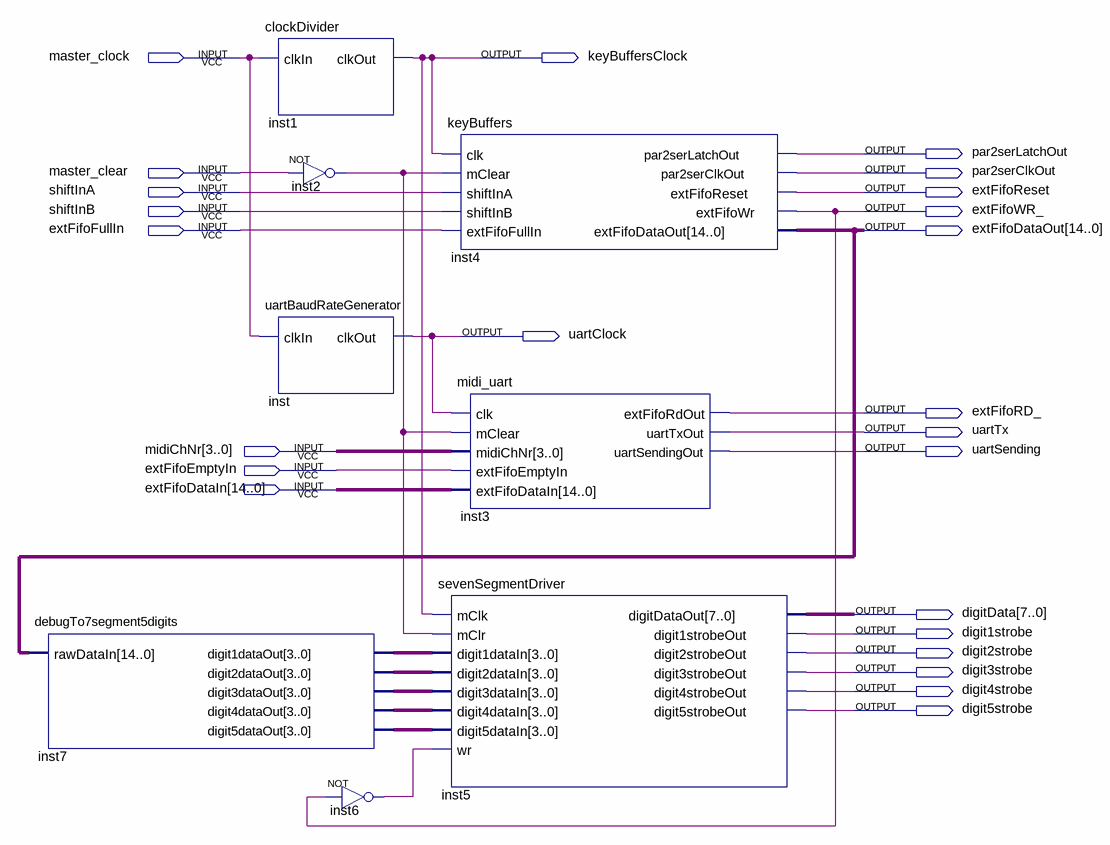
[diagram p0: schematic sheet]
// Quartus schematic Main.bdf as structural Verilog: 8 symbols, 24 pins
module Main (
  input  master_clock,
  input  master_clear,
  input  shiftInA,
  input  shiftInB,
  input  extFifoFullIn,
  input  [3:0] midiChNr,
  input  extFifoEmptyIn,
  input  [14:0] extFifoDataIn,
  output keyBuffersClock,
  output par2serLatchOut,
  output par2serClkOut,
  output extFifoReset,
  output extFifoWR_,
  output [14:0] extFifoDataOut,
  output uartClock,
  output extFifoRD_,
  output uartTx,
  output uartSending,
  output [7:0] digitData,
  output digit1strobe,
  output digit2strobe,
  output digit3strobe,
  output digit4strobe,
  output digit5strobe
);

  wire inst2_out, inst6_out;
  wire [3:0] inst7_digit1dataout, inst7_digit2dataout, inst7_digit3dataout, inst7_digit4dataout,
       inst7_digit5dataout;

  debugTo7segment5digits inst7 (
    .rawDataIn(extFifoDataOut), .digit1dataOut(inst7_digit1dataout), .digit2dataOut(inst7_digit2dataout),
    .digit3dataOut(inst7_digit3dataout), .digit4dataOut(inst7_digit4dataout),
    .digit5dataOut(inst7_digit5dataout));
  clockDivider inst1 (.clkIn(master_clock), .clkOut(keyBuffersClock));
  not inst2 (inst2_out, master_clear);
  uartBaudRateGenerator inst (.clkIn(master_clock), .clkOut(uartClock));
  not inst6 (inst6_out, extFifoWR_);
  keyBuffers inst4 (
    .clk(keyBuffersClock), .mClear(inst2_out), .shiftInA(shiftInA), .shiftInB(shiftInB),
    .extFifoFullIn(extFifoFullIn), .par2serLatchOut(par2serLatchOut), .par2serClkOut(par2serClkOut),
    .extFifoReset(extFifoReset), .extFifoWr(extFifoWR_), .extFifoDataOut(extFifoDataOut));
  midi_uart inst3 (
    .clk(uartClock), .mClear(inst2_out), .midiChNr(midiChNr), .extFifoEmptyIn(extFifoEmptyIn),
    .extFifoDataIn(extFifoDataIn), .extFifoRdOut(extFifoRD_), .uartTxOut(uartTx), .uartSendingOut(uartSending));
  sevenSegmentDriver inst5 (
    .mClk(keyBuffersClock), .mClr(inst2_out), .digit1dataIn(inst7_digit1dataout),
    .digit2dataIn(inst7_digit2dataout), .digit3dataIn(inst7_digit3dataout),
    .digit4dataIn(inst7_digit4dataout), .digit5dataIn(inst7_digit5dataout), .wr(inst6_out),
    .digitDataOut(digitData), .digit1strobeOut(digit1strobe), .digit2strobeOut(digit2strobe),
    .digit3strobeOut(digit3strobe), .digit4strobeOut(digit4strobe), .digit5strobeOut(digit5strobe));
endmodule
